# EasyEDA schematic 2020 Main Board - Schematic.json
TITLE: Main Board; REV: 1.0; Date: 2019-11-15; Sheet: 1/1; Drawn By: naichen; Company: Your Company
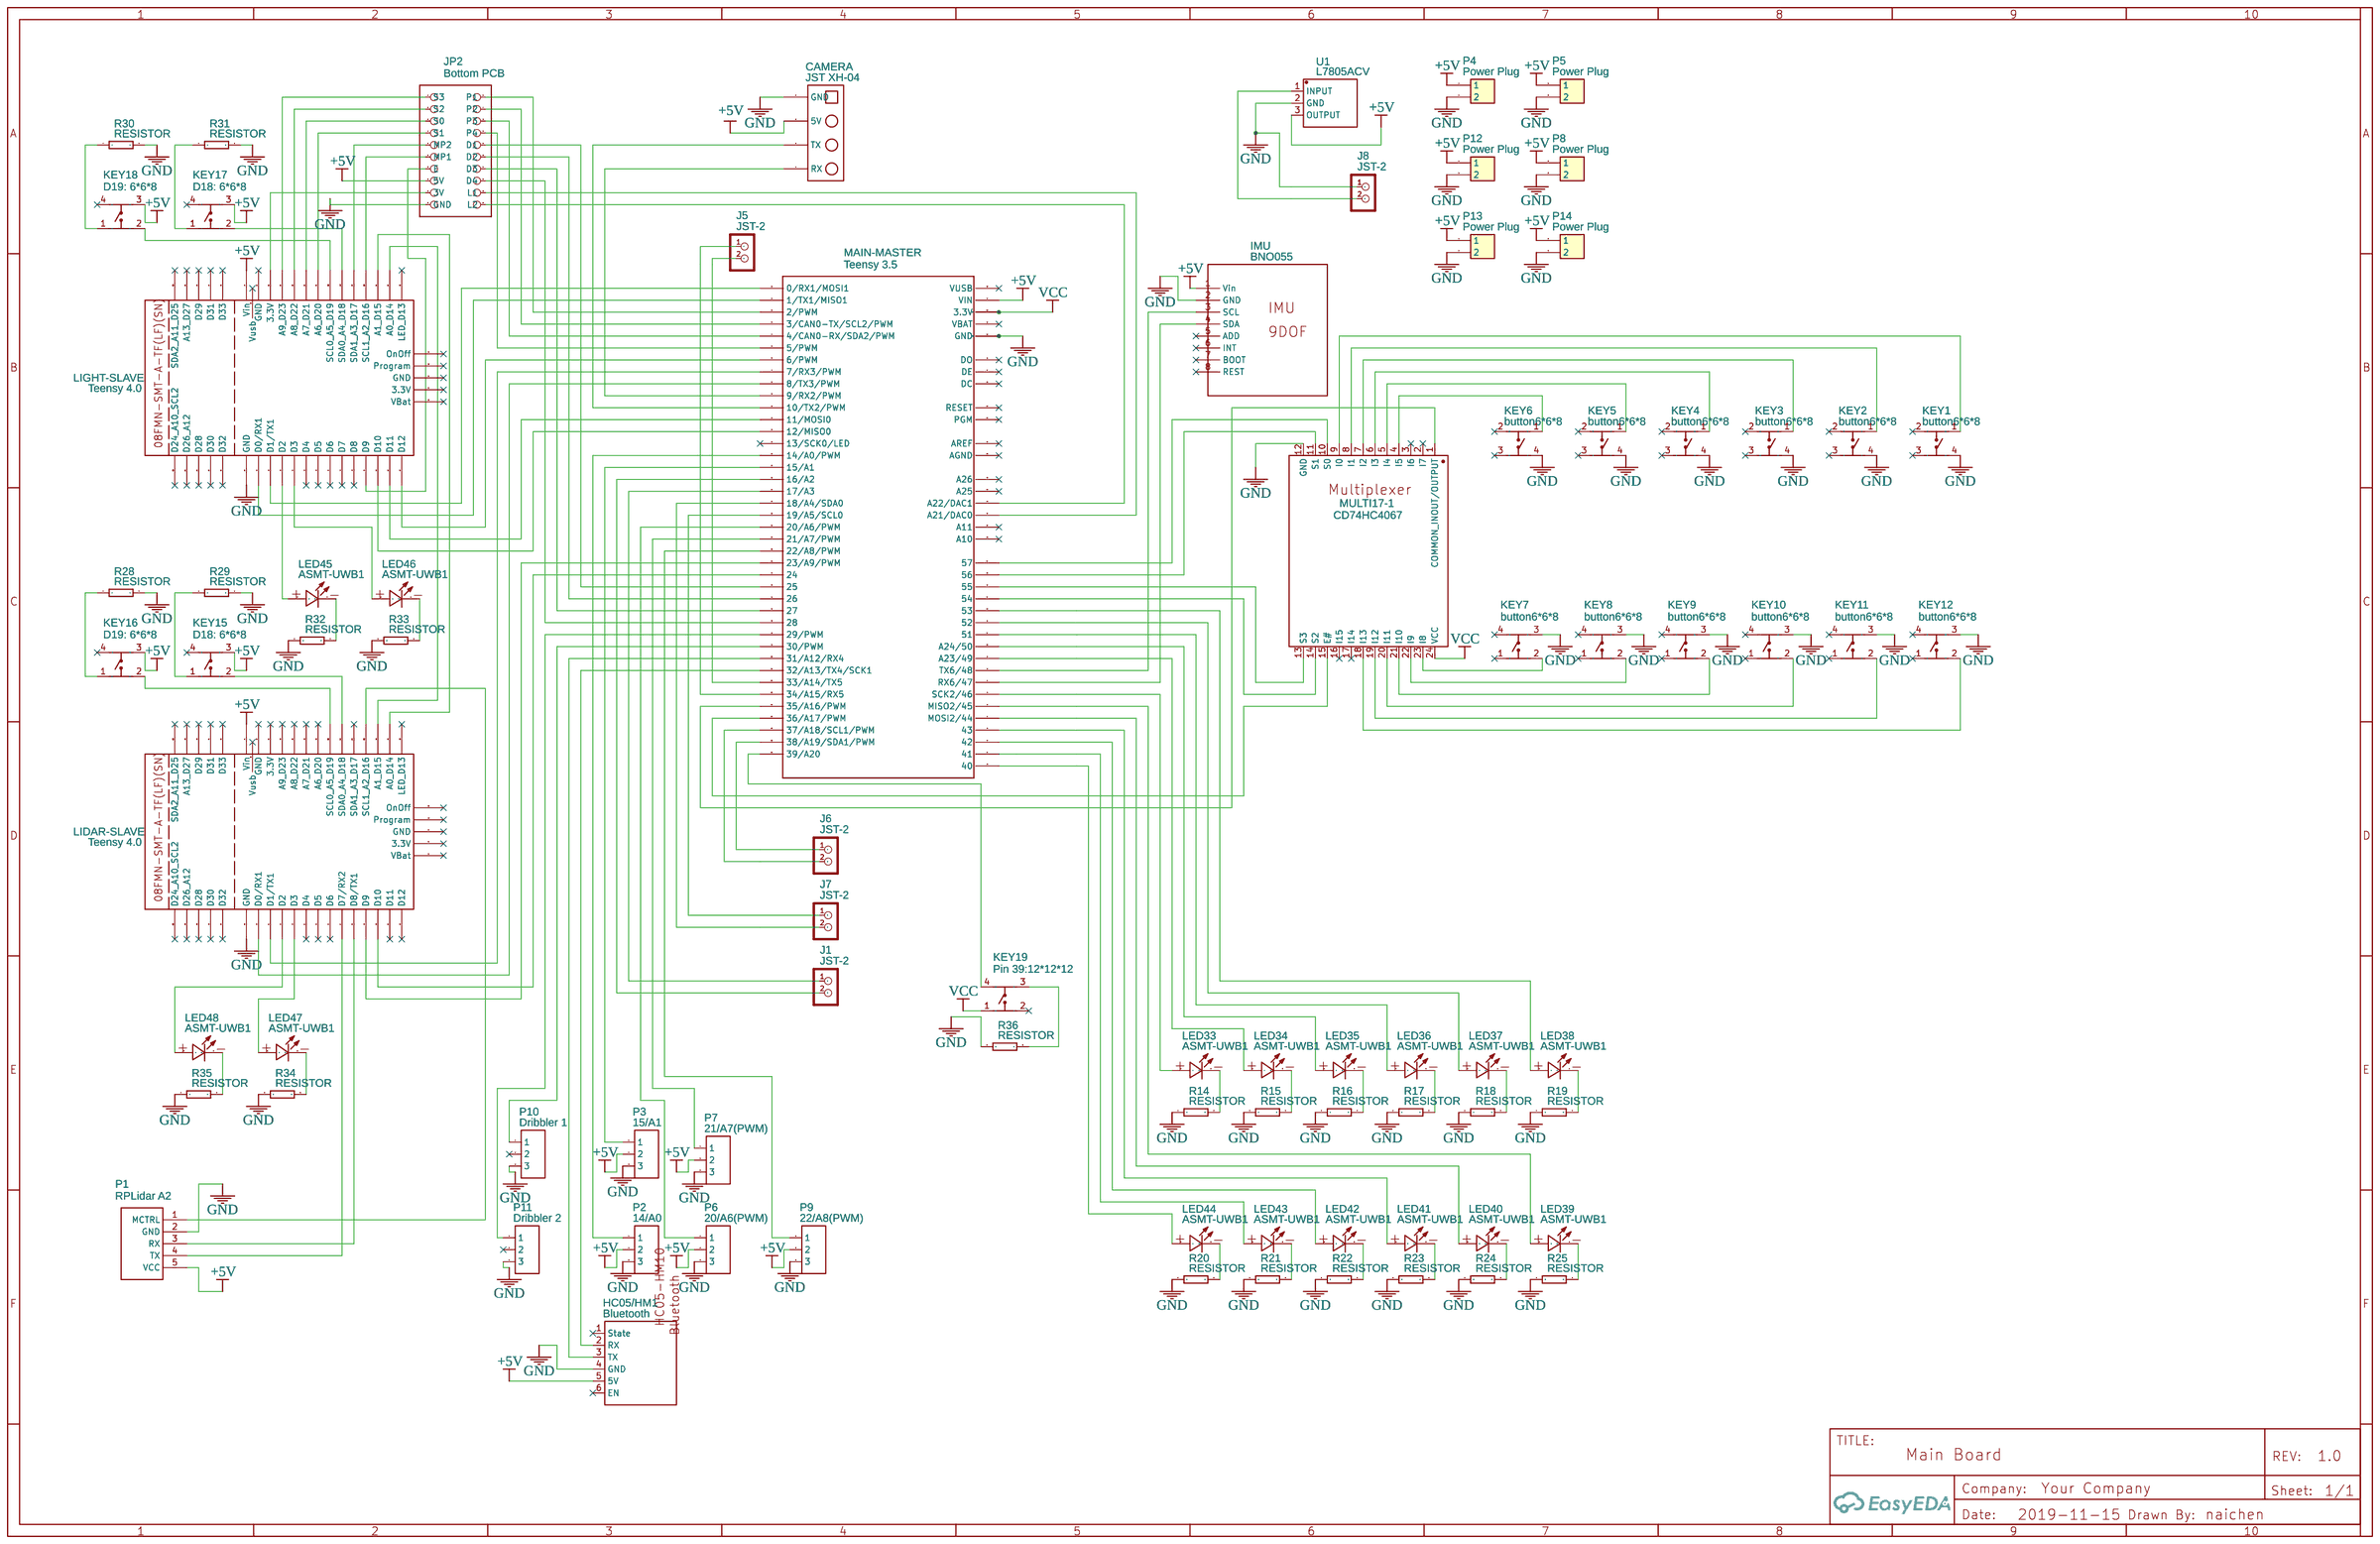
[diagram p0: schematic sheet]

## Parts
CAMERA  JST XH-04  [JST XH-04]
HC05/HM1  Bluetooth  [BLUETOOTH HC05 HM10]
IMU  BNO055  [BNO055]
J1  JST-2  [JST-2]
J5  JST-2  [JST-2]
J6  JST-2  [JST-2]
J7  JST-2  [JST-2]
J8  JST-2  [JST-2]
JP2  Bottom PCB  [PINHEAD_2X10]
KEY1  button6*6*8  [KEY-TH_4P-L6.0-W6.0-P4.50-LS7.5]
KEY2  button6*6*8  [KEY-TH_4P-L6.0-W6.0-P4.50-LS7.5]
KEY3  button6*6*8  [KEY-TH_4P-L6.0-W6.0-P4.50-LS7.5]
KEY4  button6*6*8  [KEY-TH_4P-L6.0-W6.0-P4.50-LS7.5]
KEY5  button6*6*8  [KEY-TH_4P-L6.0-W6.0-P4.50-LS7.5]
KEY6  button6*6*8  [KEY-TH_4P-L6.0-W6.0-P4.50-LS7.5]
KEY7  button6*6*8  [KEY-TH_4P-L6.0-W6.0-P4.50-LS7.5]
KEY8  button6*6*8  [KEY-TH_4P-L6.0-W6.0-P4.50-LS7.5]
KEY9  button6*6*8  [KEY-TH_4P-L6.0-W6.0-P4.50-LS7.5]
KEY10  button6*6*8  [KEY-TH_4P-L6.0-W6.0-P4.50-LS7.5]
KEY11  button6*6*8  [KEY-TH_4P-L6.0-W6.0-P4.50-LS7.5]
KEY12  button6*6*8  [KEY-TH_4P-L6.0-W6.0-P4.50-LS7.5]
KEY15  D18: 6*6*8  [KEY-TH_4P-L6.0-W6.0-P4.50-LS7.5]
KEY16  D19: 6*6*8  [KEY-TH_4P-L6.0-W6.0-P4.50-LS7.5]
KEY17  D18: 6*6*8  [KEY-TH_4P-L6.0-W6.0-P4.50-LS7.5]
KEY18  D19: 6*6*8  [KEY-TH_4P-L6.0-W6.0-P4.50-LS7.5]
KEY19  Pin 39:12*12*12  [KEY-TH_4P-L12.0-W12.0-P5.00-LS13.4]
LED33  ASMT-UWB1  [ASMT-PAD]
LED34  ASMT-UWB1  [ASMT-PAD]
LED35  ASMT-UWB1  [ASMT-PAD]
LED36  ASMT-UWB1  [ASMT-PAD]
LED37  ASMT-UWB1  [ASMT-PAD]
LED38  ASMT-UWB1  [ASMT-PAD]
LED39  ASMT-UWB1  [ASMT-PAD]
LED40  ASMT-UWB1  [ASMT-PAD]
LED41  ASMT-UWB1  [ASMT-PAD]
LED42  ASMT-UWB1  [ASMT-PAD]
LED43  ASMT-UWB1  [ASMT-PAD]
LED44  ASMT-UWB1  [ASMT-PAD]
LED45  ASMT-UWB1  [ASMT-PAD]
LED46  ASMT-UWB1  [ASMT-PAD]
LED47  ASMT-UWB1  [ASMT-PAD]
LED48  ASMT-UWB1  [ASMT-PAD]
LIDAR-SLAVE  Teensy 4.0  [TEENSY_4.0]
LIGHT-SLAVE  Teensy 4.0  [TEENSY_4.0]
MAIN-MASTER  Teensy 3.5  [TEENSY_3.5_ALL_PINS&PADS]
MULTI17-1  CD74HC4067  [SSOP-24_208MIL]
P1  RPLidar A2  [XH2.54-5P]
P2  14/A0  [HDR-3X1/2.54]
P3  15/A1  [HDR-3X1/2.54]
P4  Power Plug  [HDR-1X2/2.54]
P5  Power Plug  [HDR-1X2/2.54]
P6  20/A6(PWM)  [HDR-3X1/2.54]
P7  21/A7(PWM)  [HDR-3X1/2.54]
P8  Power Plug  [HDR-1X2/2.54]
P9  22/A8(PWM)  [HDR-3X1/2.54]
P10  Dribbler 1  [HDR-3X1/2.54]
P11  Dribbler 2  [HDR-3X1/2.54]
P12  Power Plug  [HDR-1X2/2.54]
P13  Power Plug  [HDR-1X2/2.54]
P14  Power Plug  [HDR-1X2/2.54]
R14  RESISTOR  [RTH025W]
R15  RESISTOR  [RTH025W]
R16  RESISTOR  [RTH025W]
R17  RESISTOR  [RTH025W]
R18  RESISTOR  [RTH025W]
R19  RESISTOR  [RTH025W]
R20  RESISTOR  [RTH025W]
R21  RESISTOR  [RTH025W]
R22  RESISTOR  [RTH025W]
R23  RESISTOR  [RTH025W]
R24  RESISTOR  [RTH025W]
R25  RESISTOR  [RTH025W]
R28  RESISTOR  [RTH025W]
R29  RESISTOR  [RTH025W]
R30  RESISTOR  [RTH025W]
R31  RESISTOR  [RTH025W]
R32  RESISTOR  [RTH025W]
R33  RESISTOR  [RTH025W]
R34  RESISTOR  [RTH025W]
R35  RESISTOR  [RTH025W]
R36  RESISTOR  [RTH025W]
U1  L7805ACV  [TO-220-3_L10.0-W4.5-P2.54-T]

## Library data of the parts
CAMERA = -: Manufacturer Part: JST_XH CONNECTOR; link: https://nl.aliexpress.com/item/50-sets-Kit-in-doos-2-p-3-p-4-pin-2-54mm-Pitch-Terminal-Behuizing/32681086028.html?spm=a2g0s.9042311.0.0.I0g15Z; Contributor: j.arts87
IMU = -: Contributor: vyncz
J1 J5-J8 = JST-2: Contributor: cpu76239
JP2 = -: Contributor: Airtau
KEY1-KEY12 = -: Supplier Part: C59982; Supplier: LCSC; Manufacturer: ReliaPro; image: http://image.lceda.cn/szlcsc/C59982.jpg
KEY15-KEY18 = -: Supplier Part: C59982; Supplier: LCSC; Manufacturer: ReliaPro; Manufacturer Part: button6*6*8; image: http://image.lceda.cn/szlcsc/C59982.jpg
KEY19 = -: Supplier: LCSC; Manufacturer: ReliaPro; Manufacturer Part: Switch 12*12*12; Supplier Part: C14121
LED33-LED48 = -: Supplier: LCSC; Supplier Part: C188684; Manufacturer: Broadcom; Manufacturer Part: ASMT-BG20-AS000; Contributor: LCSC
LIDAR-SLAVE LIGHT-SLAVE = -: Contributor: pintea.mihaita
MAIN-MASTER = -: Contributor: AsthmaMan
MULTI17-1 = -: sourceId: 1T5FDZYC8
P1 = -: Contributor: Very Good
P2 P3 P6 P7 P9-P11 = -: Supplier Part: C146243; Supplier: LCSC; Manufacturer: Boom Precision Elec; Manufacturer Part: Header-Female-2.54_1x3; link: https://datasheet.lcsc.com/szlcsc/Boom-Precision-Elec-2-54mm-1-8P-Straight-Female-header_C27438.pdf
P4 P5 P8 P12-P14 = -: Supplier Part: C49661; Supplier: LCSC; Manufacturer: LCSC; Manufacturer Part: Header-Female-2.54_1x2
R14-R25 R28-R36 = -: Contributor: DangerousPrototype
U1 = -: Supplier: LCSC; Supplier Part: C192854; Manufacturer: STMicroelectronics; Contributor: LCSC

## Nets
+5V: CAMERA.2(5V) HC05/HM1.5(5V) IMU.1(Vin) JP2.15(5V) KEY15.3 KEY16.3 KEY17.3 KEY18.3 LIDAR-SLAVE.Vin LIGHT-SLAVE.Vin MAIN-MASTER.VIN P1.5(VCC) P2.2 P3.2 P4.1 P5.1 P6.2 P7.2 P8.1 P9.2 P12.1 P13.1 P14.1 U1.3(OUTPUT)
GND: CAMERA.1(GND) HC05/HM1.4(GND) IMU.2(GND) J8.1 JP2.19(GND) KEY1.4 KEY2.4 KEY3.4 KEY4.4 KEY5.4 KEY6.4 KEY7.3 KEY8.3 KEY9.3 KEY10.3 KEY11.3 KEY12.3 LIDAR-SLAVE.GND LIGHT-SLAVE.GND MAIN-MASTER.GND MAIN-MASTER.GND1(GND) MAIN-MASTER.GND2(GND) MAIN-MASTER.GND3(GND) MAIN-MASTER.GND4(GND) MAIN-MASTER.GND5(GND) MAIN-MASTER.GND6(GND) MULTI17-1.12(GND) P1.2(GND) P2.3 P3.3 P4.2 P5.2 P6.3 P7.3 P8.2 P9.3 P10.3 P11.3 P12.2 P13.2 P14.2 R14.1 R15.1 R16.1 R17.1 R18.1 R19.1 R20.1 R21.1 R22.1 R23.1 R24.1 R25.1 R28.2 R29.2 R30.2 R31.2 R32.1 R33.1 R34.1 R35.1 R36.1 U1.2(GND)
VCC: KEY19.1 MAIN-MASTER.3.3V MAIN-MASTER.3.3V2(3.3V) MAIN-MASTER.3.3V3(3.3V) MAIN-MASTER.3.3V4(3.3V) MULTI17-1.24(VCC)
Net-(CAMERA-3): CAMERA.3(TX) MAIN-MASTER.10(10/TX2/PWM)
Net-(CAMERA-4): CAMERA.4(RX) MAIN-MASTER.9(9/RX2/PWM)
Net-(HC05/HM1-2): HC05/HM1.2(RX) MAIN-MASTER.32/A13(32/A13/TX4/SCK1)
Net-(HC05/HM1-3): HC05/HM1.3(TX) MAIN-MASTER.31/A12(31/A12/RX4)
Net-(IMU-3): IMU.3(SCL) MAIN-MASTER.48(TX6/48)
Net-(IMU-4): IMU.4(SDA) MAIN-MASTER.47(RX6/47)
Net-(J1-1): J1.1 MAIN-MASTER.17/A3
Net-(J1-2): J1.2 MAIN-MASTER.16/A2
Net-(J5-1): J5.1 MAIN-MASTER.34/A15(34/A15/RX5)
Net-(J5-2): J5.2 MAIN-MASTER.33/A14(33/A14/TX5)
Net-(J6-1): J6.1 MAIN-MASTER.38/A19(38/A19/SDA1/PWM)
Net-(J6-2): J6.2 MAIN-MASTER.37/A18(37/A18/SCL1/PWM)
Net-(J7-1): J7.1 MAIN-MASTER.19/A5(19/A5/SCL0)
Net-(J7-2): J7.2 MAIN-MASTER.18/A4(18/A4/SDA0)
Net-(J8-2): J8.2 U1.1(INPUT)
Net-(JP2-1): JP2.1(S3) LIGHT-SLAVE.A9_D23
Net-(JP2-2): JP2.2(P1) MAIN-MASTER.2(2/PWM)
Net-(JP2-3): JP2.3(S2) LIGHT-SLAVE.A8_D22
Net-(JP2-4): JP2.4(P2) MAIN-MASTER.3(3/CAN0-TX/SCL2/PWM)
Net-(JP2-5): JP2.5(S0) LIGHT-SLAVE.A7_D21
Net-(JP2-6): JP2.6(P3) MAIN-MASTER.4(4/CAN0-RX/SDA2/PWM)
Net-(JP2-7): JP2.7(S1) LIGHT-SLAVE.A6_D20
Net-(JP2-8): JP2.8(P4) MAIN-MASTER.5(5/PWM)
Net-(JP2-9): JP2.9(MP2) LIGHT-SLAVE.SDA1_A3_D17
Net-(JP2-10): JP2.10(D1) MAIN-MASTER.25
Net-(JP2-11): JP2.11(MP1) LIGHT-SLAVE.SCL1_A2_D16
Net-(JP2-12): JP2.12(D2) MAIN-MASTER.26
Net-(JP2-13): JP2.13(E) LIGHT-SLAVE.D9
Net-(JP2-14): JP2.14(D3) MAIN-MASTER.27
Net-(JP2-16): JP2.16(D4) MAIN-MASTER.28
Net-(JP2-17): JP2.17(3V) LIGHT-SLAVE.3.3V
Net-(JP2-18): JP2.18(L1) MAIN-MASTER.A21(A21/DAC0)
Net-(JP2-20): JP2.20(L2) MAIN-MASTER.A22(A22/DAC1)
Net-(KEY1-1): KEY1.1 MULTI17-1.9(I0)
Net-(KEY2-1): KEY2.1 MULTI17-1.8(I1)
Net-(KEY3-1): KEY3.1 MULTI17-1.7(I2)
Net-(KEY4-1): KEY4.1 MULTI17-1.6(I3)
Net-(KEY5-1): KEY5.1 MULTI17-1.5(I4)
Net-(KEY6-1): KEY6.1 MULTI17-1.4(I5)
Net-(KEY7-2): KEY7.2 MULTI17-1.23(I8)
Net-(KEY8-2): KEY8.2 MULTI17-1.22(I9)
Net-(KEY9-2): KEY9.2 MULTI17-1.21(I10)
Net-(KEY10-2): KEY10.2 MULTI17-1.20(I11)
Net-(KEY11-2): KEY11.2 MULTI17-1.19(I12)
Net-(KEY12-2): KEY12.2 MULTI17-1.18(I13)
Net-(KEY15-1): KEY15.1 R29.1
Net-(KEY15-2): KEY15.2 LIDAR-SLAVE.SDA0_A4_D18
Net-(KEY16-1): KEY16.1 R28.1
Net-(KEY16-2): KEY16.2 LIDAR-SLAVE.SCL0_A5_D19
Net-(KEY17-1): KEY17.1 R31.1
Net-(KEY17-2): KEY17.2 LIGHT-SLAVE.SDA0_A4_D18
Net-(KEY18-1): KEY18.1 R30.1
Net-(KEY18-2): KEY18.2 LIGHT-SLAVE.SCL0_A5_D19
Net-(KEY19-3): KEY19.3 R36.2
Net-(KEY19-4): KEY19.4 MAIN-MASTER.39/A20
Net-(LED33-1): LED33.1(A) MAIN-MASTER.46(SCK2/46)
Net-(LED33-2): LED33.2(C) R14.2
Net-(LED34-1): LED34.1(A) MAIN-MASTER.49(A23/49)
Net-(LED34-2): LED34.2(C) R15.2
Net-(LED35-1): LED35.1(A) MAIN-MASTER.50(A24/50)
Net-(LED35-2): LED35.2(C) R16.2
Net-(LED36-1): LED36.1(A) MAIN-MASTER.51
Net-(LED36-2): LED36.2(C) R17.2
Net-(LED37-1): LED37.1(A) MAIN-MASTER.52
Net-(LED37-2): LED37.2(C) R18.2
Net-(LED38-1): LED38.1(A) MAIN-MASTER.53
Net-(LED38-2): LED38.2(C) R19.2
Net-(LED39-1): LED39.1(A) MAIN-MASTER.45(MISO2/45)
Net-(LED39-2): LED39.2(C) R25.2
Net-(LED40-1): LED40.1(A) MAIN-MASTER.44(MOSI2/44)
Net-(LED40-2): LED40.2(C) R24.2
Net-(LED41-1): LED41.1(A) MAIN-MASTER.43
Net-(LED41-2): LED41.2(C) R23.2
Net-(LED42-1): LED42.1(A) MAIN-MASTER.42
Net-(LED42-2): LED42.2(C) R22.2
Net-(LED43-1): LED43.1(A) MAIN-MASTER.41
Net-(LED43-2): LED43.2(C) R21.2
Net-(LED44-1): LED44.1(A) MAIN-MASTER.40
Net-(LED44-2): LED44.2(C) R20.2
Net-(LED45-1): LED45.1(A) LIGHT-SLAVE.D2
Net-(LED45-2): LED45.2(C) R32.2
Net-(LED46-1): LED46.1(A) LIGHT-SLAVE.D3
Net-(LED46-2): LED46.2(C) R33.2
Net-(LED47-1): LED47.1(A) LIDAR-SLAVE.D3
Net-(LED47-2): LED47.2(C) R34.2
Net-(LED48-1): LED48.1(A) LIDAR-SLAVE.D2
Net-(LED48-2): LED48.2(C) R35.2
Net-(LIDAR-SLAVE-A0_D14): LIDAR-SLAVE.A0_D14 LIGHT-SLAVE.A1_D15
Net-(LIDAR-SLAVE-A1_D15): LIDAR-SLAVE.A1_D15 LIGHT-SLAVE.A0_D14
Net-(LIDAR-SLAVE-D0): LIDAR-SLAVE.D0(D0/RX1) MAIN-MASTER.8(8/TX3/PWM)
Net-(LIDAR-SLAVE-D1): LIDAR-SLAVE.D1(D1/TX1) MAIN-MASTER.7(7/RX3/PWM)
Net-(LIDAR-SLAVE-D7): LIDAR-SLAVE.D7(D7/RX2) P1.4(TX)
Net-(LIDAR-SLAVE-D8): LIDAR-SLAVE.D8(D8/TX1) P1.3(RX)
Net-(LIDAR-SLAVE-D9): LIDAR-SLAVE.D9 MAIN-MASTER.23/A9(23/A9/PWM)
Net-(LIDAR-SLAVE-D10): LIDAR-SLAVE.D10 MAIN-MASTER.24
Net-(LIDAR-SLAVE-SCL1_A2_D16): LIDAR-SLAVE.SCL1_A2_D16 P1.1(MCTRL)
Net-(LIGHT-SLAVE-D0): LIGHT-SLAVE.D0(D0/RX1) MAIN-MASTER.1(1/TX1/MISO1)
Net-(LIGHT-SLAVE-D1): LIGHT-SLAVE.D1(D1/TX1) MAIN-MASTER.0(0/RX1/MOSI1)
Net-(LIGHT-SLAVE-D10): LIGHT-SLAVE.D10 MAIN-MASTER.12(12/MISO0)
Net-(LIGHT-SLAVE-D11): LIGHT-SLAVE.D11 MAIN-MASTER.11(11/MOSI0)
Net-(LIGHT-SLAVE-D12): LIGHT-SLAVE.D12 MAIN-MASTER.6(6/PWM)
Net-(MAIN-MASTER-14/A0): MAIN-MASTER.14/A0(14/A0/PWM) P2.1
Net-(MAIN-MASTER-15/A1): MAIN-MASTER.15/A1 P3.1
Net-(MAIN-MASTER-20/A6): MAIN-MASTER.20/A6(20/A6/PWM) P6.1
Net-(MAIN-MASTER-21/A7): MAIN-MASTER.21/A7(21/A7/PWM) P7.1
Net-(MAIN-MASTER-22/A8): MAIN-MASTER.22/A8(22/A8/PWM) P9.1
Net-(MAIN-MASTER-29): MAIN-MASTER.29(29/PWM) P11.1
Net-(MAIN-MASTER-30): MAIN-MASTER.30(30/PWM) P10.1
Net-(MAIN-MASTER-35/A16): MAIN-MASTER.35/A16(35/A16/PWM) MULTI17-1.1(COMMON INOUT/OUTPUT)
Net-(MAIN-MASTER-36/A17): MAIN-MASTER.36/A17(36/A17/PWM) MULTI17-1.15(E#)
Net-(MAIN-MASTER-54): MAIN-MASTER.54 MULTI17-1.14(S2)
Net-(MAIN-MASTER-55): MAIN-MASTER.55 MULTI17-1.13(S3)
Net-(MAIN-MASTER-56): MAIN-MASTER.56 MULTI17-1.11(S1)
Net-(MAIN-MASTER-57): MAIN-MASTER.57 MULTI17-1.10(S0)

Not connected (* = marked no-connect by the designer): HC05/HM1 1(State)* 6(EN)*; IMU 5(ADD)* 6(INT)* 7(BOOT)* 8(REST)*; KEY1 2* 3*; KEY2 2* 3*; KEY3 2* 3*; KEY4 2* 3*; KEY5 2* 3*; KEY6 2* 3*; KEY7 1* 4*; KEY8 1* 4*; KEY9 1* 4*; KEY10 1* 4*; KEY11 1* 4*; KEY12 1* 4*; KEY15 4*; KEY16 4*; KEY17 4*; KEY18 4*; KEY19 2*; LIDAR-SLAVE 3.3V* A6_D20* A7_D21* A8_D22* A9_D23* A13_D27* D4* D5* D6* D11* D12* D24_A10_SCL2* D26_A12* D28* D29* D30* D31* D32* D33* LED_D13* OnOff* Program* SDA1_A3_D17* SDA2_A11_D25* VBat* Vusb*; LIGHT-SLAVE A13_D27* D4* D5* D6* D7* D8* D24_A10_SCL2* D26_A12* D28* D29* D30* D31* D32* D33* LED_D13* OnOff* Program* SDA2_A11_D25* VBat* Vusb*; MAIN-MASTER 13(13/SCK0/LED)* A10* A11* A25* A26* AGND* AREF* DC* DE* DO* PGM* RESET* VBAT* VUSB*; MULTI17-1 2(I7)* 3(I6)* 16(I15)* 17(I14)*; P10 2*; P11 2*
